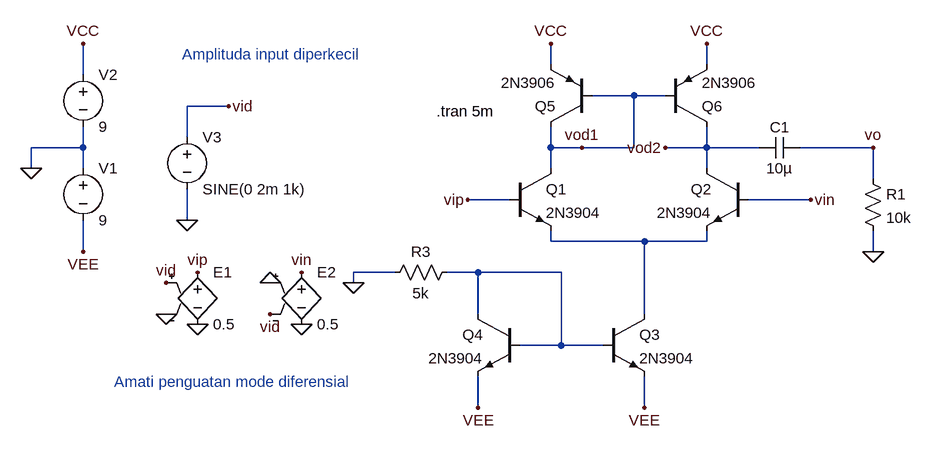
[diagram p0: schematic Perc-01-06-differentialmode.asc]
Perc-01-06-differentialmode.asc, the LTspice schematic file:
Version 4
SHEET 1 964 680
WIRE 400 -48 400 -80
WIRE 640 -48 640 -80
WIRE -320 -32 -320 -80
WIRE 528 0 464 0
WIRE 576 0 528 0
WIRE -96 16 -160 16
WIRE -160 64 -160 16
WIRE -320 80 -320 48
WIRE -320 80 -400 80
WIRE 400 80 400 48
WIRE 448 80 400 80
WIRE 528 80 528 0
WIRE 528 80 448 80
WIRE 640 80 640 48
WIRE 640 80 576 80
WIRE 720 80 640 80
WIRE 896 80 784 80
WIRE -400 112 -400 80
WIRE -320 112 -320 80
WIRE 400 112 400 80
WIRE 640 112 640 80
WIRE 896 128 896 80
WIRE 336 160 272 160
WIRE 800 160 704 160
WIRE -160 192 -160 144
WIRE 400 224 400 208
WIRE 544 224 400 224
WIRE 640 224 640 208
WIRE 640 224 544 224
WIRE -320 240 -320 192
WIRE 896 240 896 208
WIRE 160 272 96 272
WIRE 288 272 240 272
WIRE 416 272 288 272
WIRE 96 288 96 272
WIRE 288 336 288 272
WIRE 544 336 544 224
WIRE 416 384 416 272
WIRE 416 384 352 384
WIRE 480 384 416 384
WIRE 288 480 288 432
WIRE 544 480 544 432
FLAG 400 -80 VCC
FLAG 640 -80 VCC
FLAG 448 80 vod1
FLAG 576 80 vod2
FLAG -320 -80 VCC
FLAG -320 240 VEE
FLAG -400 112 0
FLAG -160 192 0
FLAG -96 16 vid
FLAG 96 288 0
FLAG 288 480 VEE
FLAG 544 480 VEE
FLAG 896 240 0
FLAG 896 80 vo
FLAG -192 288 vid
FLAG -32 336 vid
FLAG -144 272 vip
FLAG 272 160 vip
FLAG 16 272 vin
FLAG 800 160 vin
FLAG -192 336 0
FLAG -144 352 0
FLAG 16 352 0
FLAG -32 288 0
SYMBOL npn 336 112 R0
SYMATTR InstName Q1
SYMATTR Value 2N3904
SYMBOL npn 704 112 M0
SYMATTR InstName Q2
SYMATTR Value 2N3904
SYMBOL voltage -320 96 R0
WINDOW 123 0 0 Left 0
WINDOW 39 0 0 Left 0
SYMATTR InstName V1
SYMATTR Value 9
SYMBOL voltage -320 -48 R0
WINDOW 123 0 0 Left 0
WINDOW 39 0 0 Left 0
SYMATTR InstName V2
SYMATTR Value 9
SYMBOL voltage -160 48 R0
WINDOW 123 0 0 Left 0
WINDOW 39 0 0 Left 0
SYMATTR InstName V3
SYMATTR Value SINE(0 2m 1k)
SYMBOL npn 480 336 R0
SYMATTR InstName Q3
SYMATTR Value 2N3904
SYMBOL npn 352 336 M0
SYMATTR InstName Q4
SYMATTR Value 2N3904
SYMBOL res 256 256 R90
WINDOW 0 0 56 VBottom 2
WINDOW 3 32 56 VTop 2
SYMATTR InstName R3
SYMATTR Value 5k
SYMBOL pnp 464 48 R180
SYMATTR InstName Q5
SYMATTR Value 2N3906
SYMBOL pnp 576 48 M180
SYMATTR InstName Q6
SYMATTR Value 2N3906
SYMBOL cap 784 64 R90
WINDOW 0 0 32 VBottom 2
WINDOW 3 32 32 VTop 2
SYMATTR InstName C1
SYMATTR Value 10µ
SYMBOL res 880 112 R0
SYMATTR InstName R1
SYMATTR Value 10k
SYMBOL e -144 256 R0
SYMATTR InstName E1
SYMATTR Value 0.5
SYMBOL e 16 256 R0
SYMATTR InstName E2
SYMATTR Value 0.5
TEXT 224 24 Left 2 !.tran 5m
TEXT -272 440 Left 2 ;Amati penguatan mode diferensial
TEXT -168 -64 Left 2 ;Amplituda input diperkecil

The netlist it stands for:
* Perc-01-06-differentialmode.asc
Q1 vod1 vip N001 0 2N3904
Q2 vod2 vin N001 0 2N3904
V1 0 VEE 9
V2 VCC 0 9
V3 vid 0 SINE(0 2m 1k)
Q3 N001 N002 VEE 0 2N3904
Q4 N002 N002 VEE 0 2N3904
R3 N002 0 5k
Q5 vod1 vod1 VCC 0 2N3906
Q6 vod2 vod1 VCC 0 2N3906
C1 vo vod2 10µ
R1 vo 0 10k
E1 vip 0 vid 0 0.5
E2 vin 0 0 vid 0.5
.model NPN NPN
.model PNP PNP
.lib standard.bjt
.tran 5m
* Amati penguatan mode diferensial
* Amplituda input diperkecil
.backanno
.end